# EAGLE design Heater_Control_v2 (EAGLE 9.6.2)
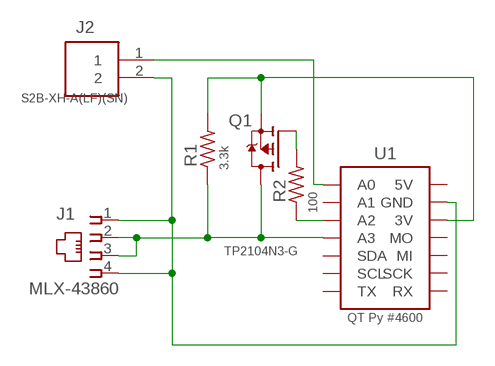
[diagram p0: schematic, sheet 1]

## Parts
J1  MLX-43860  [MLX-43860]
J2  S2B-XH-A(LF)(SN)  [HDR-02/RA]
Q1  TP2104N3-G  MOSFET-PCH-TO92  [TO92-]
R1  3.3k  R-US_R1206  [R1206]
R2  100  R-US_R1206  [R1206]
U1  QT Py #4600  QT_PY  [QT_PY-TH]

## Nets
3V3 [12mil]: Q1.1(S) R1.2 U1.3V3@1(3V) U1.3V3@2(3V)
DATA-1WIRE [12mil]: J1.2 J1.3 Q1.3(D) R1.1 U1.A3@1(A3) U1.A3@2(A3)
GATE [8mil]: Q1.2(G) R2.2
GND [12mil]: J1.1 J1.4 J2.2 U1.GND@1(GND) U1.GND@2(GND)
PWR [10mil]: J2.1 U1.A0@1(A0) U1.A0@2(A0)
SPU_GATE [8mil]: R2.1 U1.A2@1(A2) U1.A2@2(A2)
Unconnected: U1.A1@1(A1) U1.A1@2(A1) U1.MISO@1(MI) U1.MISO@2(MI) U1.MOSI@1(MO) U1.MOSI@2(MO) U1.RX@1(RX) U1.RX@2(RX) U1.SCL@1(SCL) U1.SCL@2(SCL) U1.SCLK@1(SCK) U1.SCLK@2(SCK) U1.SDA@1(SDA) U1.SDA@2(SDA) U1.TX@1(TX) U1.TX@2(TX)

## Power pins joined to a net without a drawn wire
5V: U1.5V@1(5V) U1.5V@2(5V)

## Library data of the parts
J1 = home:MLX-43860: RJ11 Connector Source: MOLEX 43860-003; FAM: 43860; MF: MOLEX; VAR: 0003
J2 = Connectors:S2B-XH-A(LF)(SN): CONN HEADER R/A 2POS 2.5MM Manufacturer's datasheet <http://www.jst-mfg.com/product/pdf/eng/eXH.pdf>; CREATED_BY: PCBLayout.com; DIGIKEY_PART_NUMBER: 455-2257-ND; MANUFACTURER: JST Sales America Inc.; MPN: S2B-XH-A(LF)(SN)
Q1 = home:MOSFET-PCH
R1 R2 = home:R-US_: RESISTOR, American symbol
U1 = home:QT_PY: Adafruit QT Py SAMD21 product #4600.

## Net classes
1 10mil: width 0.254 mm
2 12mil: width 0.305 mm
3 8mil: width 0.203 mm

## Board
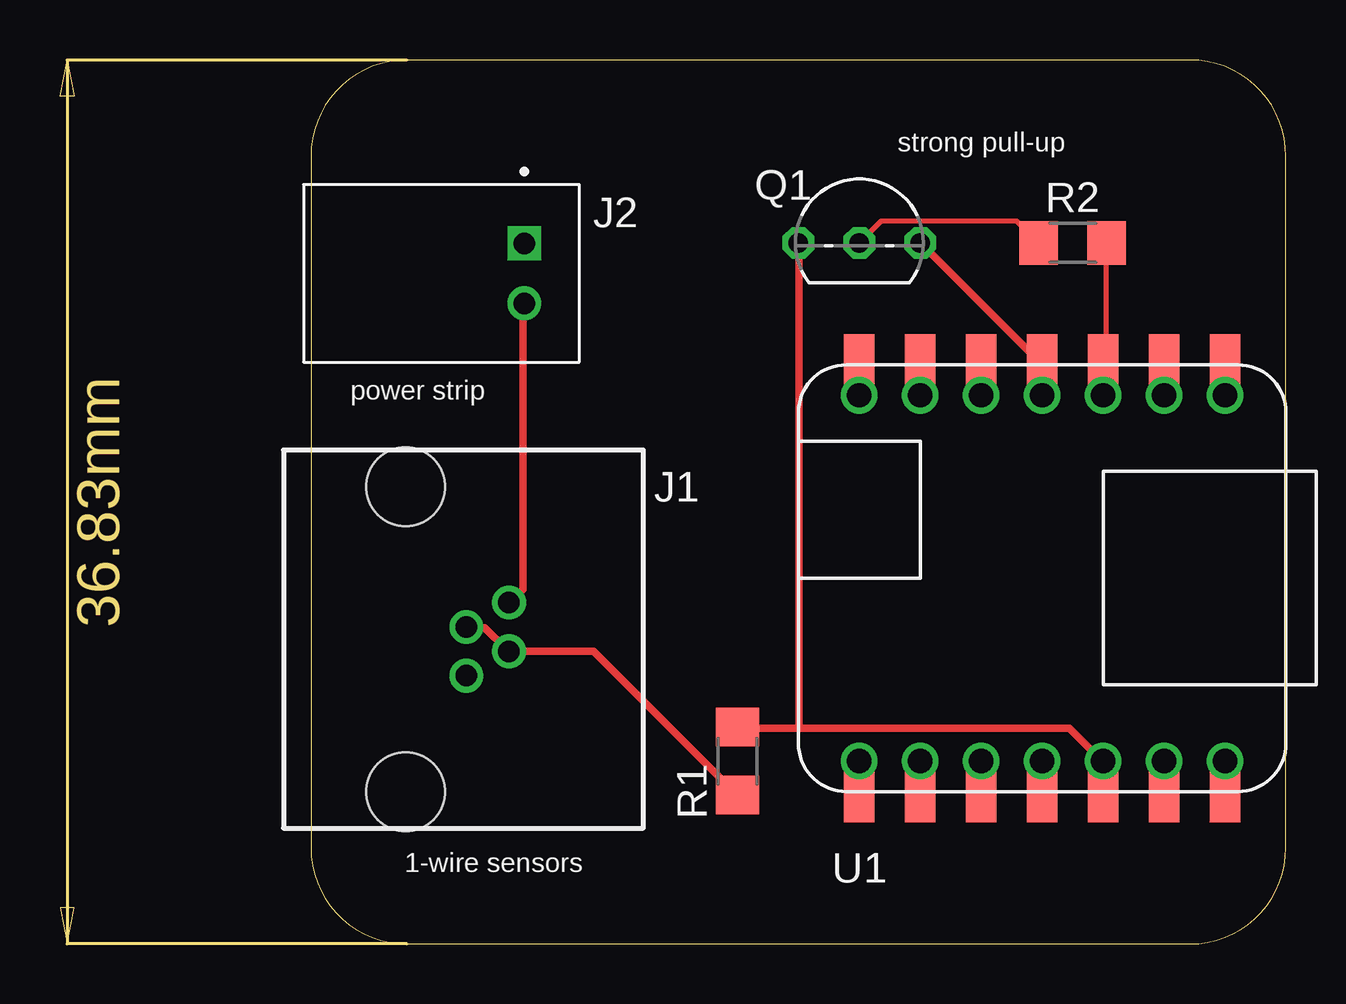
[diagram p1: board, top side]
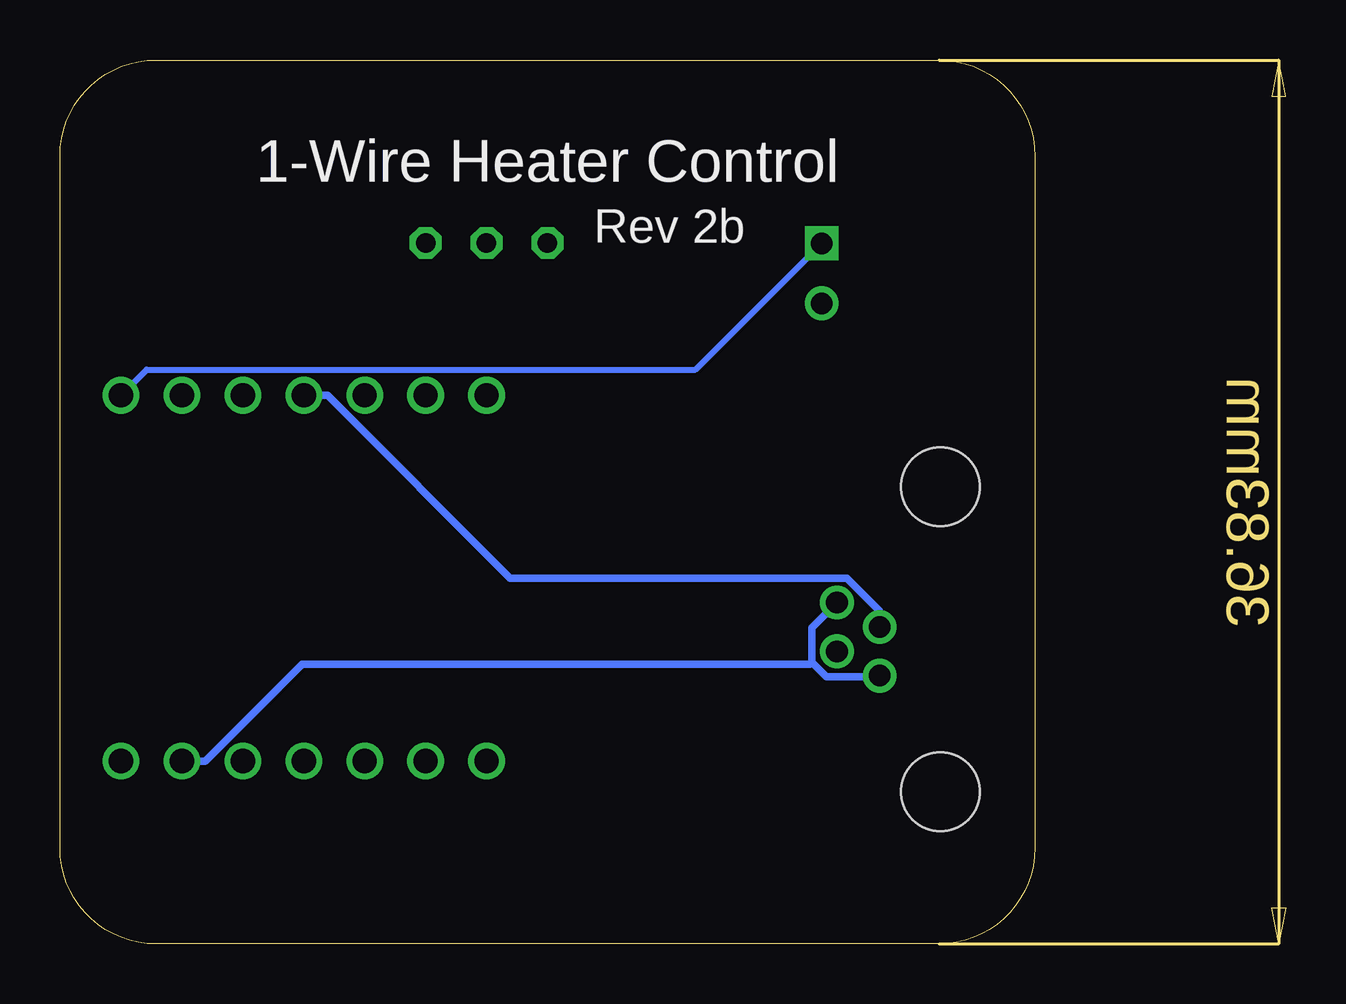
[diagram p2: board, bottom side, seen from below]

Size 40.64 x 36.83 mm. Coordinates in mm from the lower left corner, seen from the top.
Outline: 0,32.83 0,4 arc90 4,0 36.64,0 arc90 40.64,4 40.64,32.83 arc90 36.64,36.83 4,36.83 arc90 0,32.83
Copper layers (1*16): Top 0.035mm / dielectric 1.5mm / Bottom 0.035mm
Design rules "default": minimum track width 6mil, minimum drill 0.35mm, track to track 6mil, track to pad 6mil, pad to pad 6mil, via to via 6mil, smd to smd 6mil, copper to edge 40mil, drill to drill 6mil, minimum pad ring 10mil, minimum via ring 8mil, stop-mask expansion 4mil, vias tented up to drill 0mil, thermal gap 10mil

### Footprints (pad centres in the part's own frame; a part is rotated, then mirrored left to right if it is on the bottom)
MLX-43860 = drill 0.9 pad 0.914: 1 1.524,0.127; 2 0.508,1.905; 3 -0.508,0.127; 4 -1.524,1.905 | hole 3.277: -6.35,-2.413; 6.35,-2.413
HDR-02/RA = drill 0.9 square: 1 -1.25,0 | drill 0.9: 2 1.25,0
TO92- = drill 0.813 octagon: 1 -2.54,0; 2 0,0; 3 2.54,0
R1206 = smd 1.6 x 1.803: 1 -1.422,0; 2 1.422,0
QT_PY-TH = drill 1.016: 3V3@1 7.62,2.54; 5V@1 7.62,7.62; A0@1 -7.62,7.62; A1@1 -7.62,5.08; A2@1 -7.62,2.54; A3@1 -7.62,0; GND@1 7.62,5.08; MISO@1 7.62,-2.54; MOSI@1 7.62,0; RX@1 7.62,-7.62; SCL@1 -7.62,-5.08; SCLK@1 7.62,-5.08; SDA@1 -7.62,-2.54; TX@1 -7.62,-7.62 | smd 2.54 x 1.27: 3V3@2 8.89,2.54; 5V@2 8.89,7.62; A0@2 -8.89,7.62; A1@2 -8.89,5.08; A2@2 -8.89,2.54; A3@2 -8.89,0; GND@2 8.89,5.08; MISO@2 8.89,-2.54; MOSI@2 8.89,0; RX@2 8.89,-7.62; SCL@2 -8.89,-5.08; SCLK@2 8.89,-5.08; SDA@2 -8.89,-2.54; TX@2 -8.89,-7.62

### Placement (x,y rotation side)
J1  6.35,12.7 270 top
J2  8.89,27.94 270 top
Q1  22.86,29.21 0 top
R1  17.78,7.62 90 top
R2  31.75,29.21 180 top
U1  30.48,15.24 270 top

### Tracks (layer width: path | path; a pad name or v marks a point on that pad's centre or on a via)
3V3
  Top 0.305: 20.34,8.99 31.62,8.99 32.99,7.62 U1.3V3@1 33.07,7.54 33.07,6.4 U1.3V3@2 | 20.34,8.99 17.83,8.99 R1.2 | 20.34,8.99 20.34,29.18 Q1.1
5V
  Top 0.254: U1.5V@1 U1.5V@2
DATA-1WIRE
  Top 0.305: U1.A3@1 U1.A3@2 Q1.3 | J1.3 6.48,13.18 7.24,13.18 8.15,12.27 J1.2 11.79,12.19 R1.1
  Bottom 0.305: U1.A3@1 29.49,22.86 21.87,15.24 7.84,15.24 6.48,13.87 J1.3
GATE
  Top 0.203: Q1.2 23.77,30.12 29.41,30.12 R2.2
GND
  Top 0.305: U1.GND@2 35.59,6.4 35.59,7.62 U1.GND@1 | J2.2 8.84,26.67 8.84,14.78 8.31,14.25 J1.4
  Bottom 0.305: 9.3,11.73 8.69,11.12 6.48,11.12 J1.1 | 9.3,11.73 9.3,13.18 J1.4 | U1.GND@1 34.59,7.62 30.56,11.66 9.37,11.66 9.3,11.73
PWR
  Top 0.254: U1.A0@1 U1.A0@2
  Bottom 0.254: U1.A0@1 37.03,23.93 14.15,23.93 J2.1
SPU_GATE
  Top 0.203: R2.1 33.15,29.18 33.15,24.23 33.07,24.16 U1.A2@2 33.07,24.08 33.07,22.86 U1.A2@1

### Text on the board
tPlace: strong pull-up | power strip | 1-wire sensors
bPlace: 1-Wire Heater Control | Rev 2b